# Altium schematic sheet CLKB_temp_sensors.SchDoc
size A
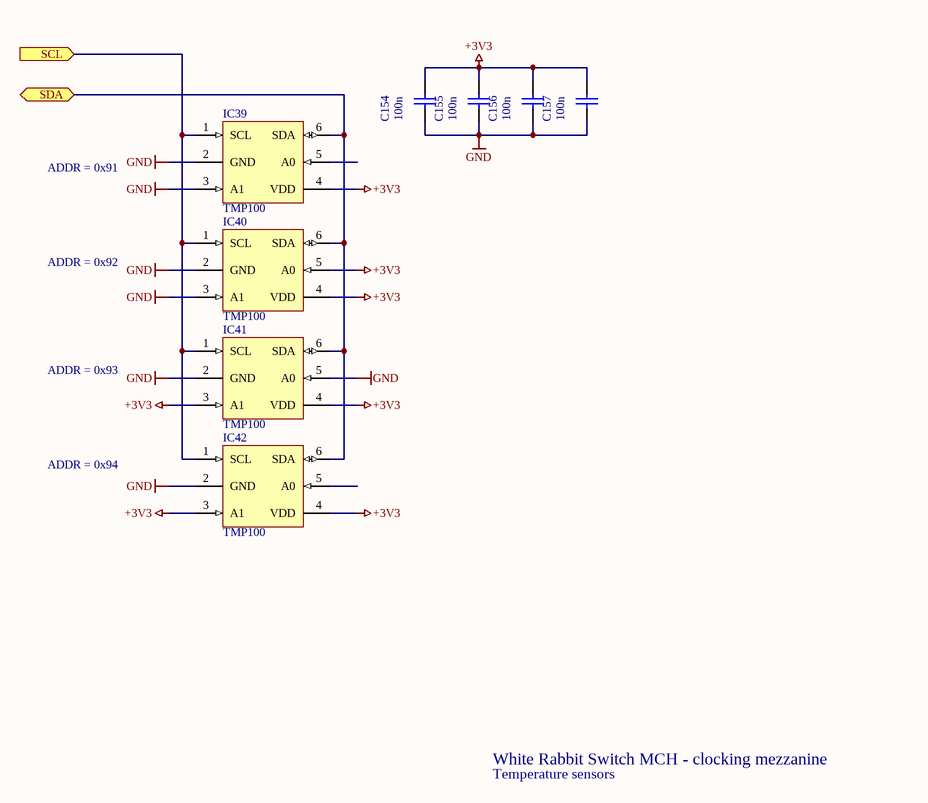
[diagram p0: CLKB_temp_sensors.SchDoc]

## Parts
C154  100n  [CAPC1608X87N]
C155  100n  [CAPC1608X87N]
C156  100n  [CAPC1608X87N]
C157  100n  [CAPC1608X87N]
IC39  TMP100  [SOT23A-6L]
IC40  TMP100  [SOT23A-6L]
IC41  TMP100  [SOT23A-6L]
IC42  TMP100  [SOT23A-6L]

## Ports
SCL (in), SDA (bidir)

## Nets
+3V3: C154.2 C155.2 C156.2 C157.2 IC39.4(VDD) IC40.4(VDD) IC40.5(A0) IC41.3(A1) IC41.4(VDD) IC42.3(A1) IC42.4(VDD)
GND: C154.1 C155.1 C156.1 C157.1 IC39.2(GND) IC39.3(A1) IC40.2(GND) IC40.3(A1) IC41.2(GND) IC41.5(A0) IC42.2(GND)
SCL: IC39.1(SCL) IC40.1(SCL) IC41.1(SCL) IC42.1(SCL) ; port SCL
SDA: IC39.6(SDA) IC40.6(SDA) IC41.6(SDA) IC42.6(SDA) ; port SDA

Not connected (* = marked no-connect by the designer): IC39 5(A0); IC42 5(A0)

## Notes on the sheet
- ADDR = 0x91
- ADDR = 0x92
- ADDR = 0x93
- ADDR = 0x94
- White Rabbit Switch MCH - clocking mezzanine
- Temperature sensors

## Library data of the parts
C154-C157 = CC0603_100NF_50V_10%_X7R: Non-polarised capacitor; Part Description: SMD Multilayer Chip Ceramic Capacitor; Manufacturer: GENERIC; Manufacturer1 Part Number: 223858615649; Manufacturer1 Datasheet: \\cern.ch\dfs\Applications\Altium\Datasheets\CC0603_X7R_PHYCOMP.pdf; Value: 100nF; Voltage: 50V; TC: X7R; Tolerance: ±10%; Table: Capacitors SMD; Part Number: CC0603_100NF_50V_10%_X7R; Component Kind: Standard; Component Type: Standard; Designator: Capacitor - non polarized; Library Reference: Capacitor - non polarized; Pin Count: 2; Status: Preferred; Manufacturer Part Number: CC0603_100NF_50V_10%_X7R; Case: 0603; Mounted: Yes; Socket: No; SMD: Yes; Manufacturer1 Example: PHYCOMP; Manufacturer1 ComponentHeight: 0.87mm; HelpURL: \\cern.ch\dfs\Applications\Altium\Datasheets\CC0603_X7R_PHYCOMP.pdf; Author: CERN DEM JLC; CreateDate: 12/3/2007; LatestRevisionDate: 12/3/2007
IC39-IC42 = TMP100: I2C temp. sensor; RefId: 296-12750-1-ND; Value: TMP101NA/250; Supplier: Digikey